# EasyEDA Pro project ProPrj_温湿度计.epro

# Schematic Schematic1
Assembly Variant: Basic; Board Name: Board1; Create Date: 2026-04-13; Page Name: P1; Project Name: 温湿度计; Schematic Name: Schematic1; Update Date: 2026-04-13; Company: 嘉立创EDA; Page Size: A4; Version: V1.0
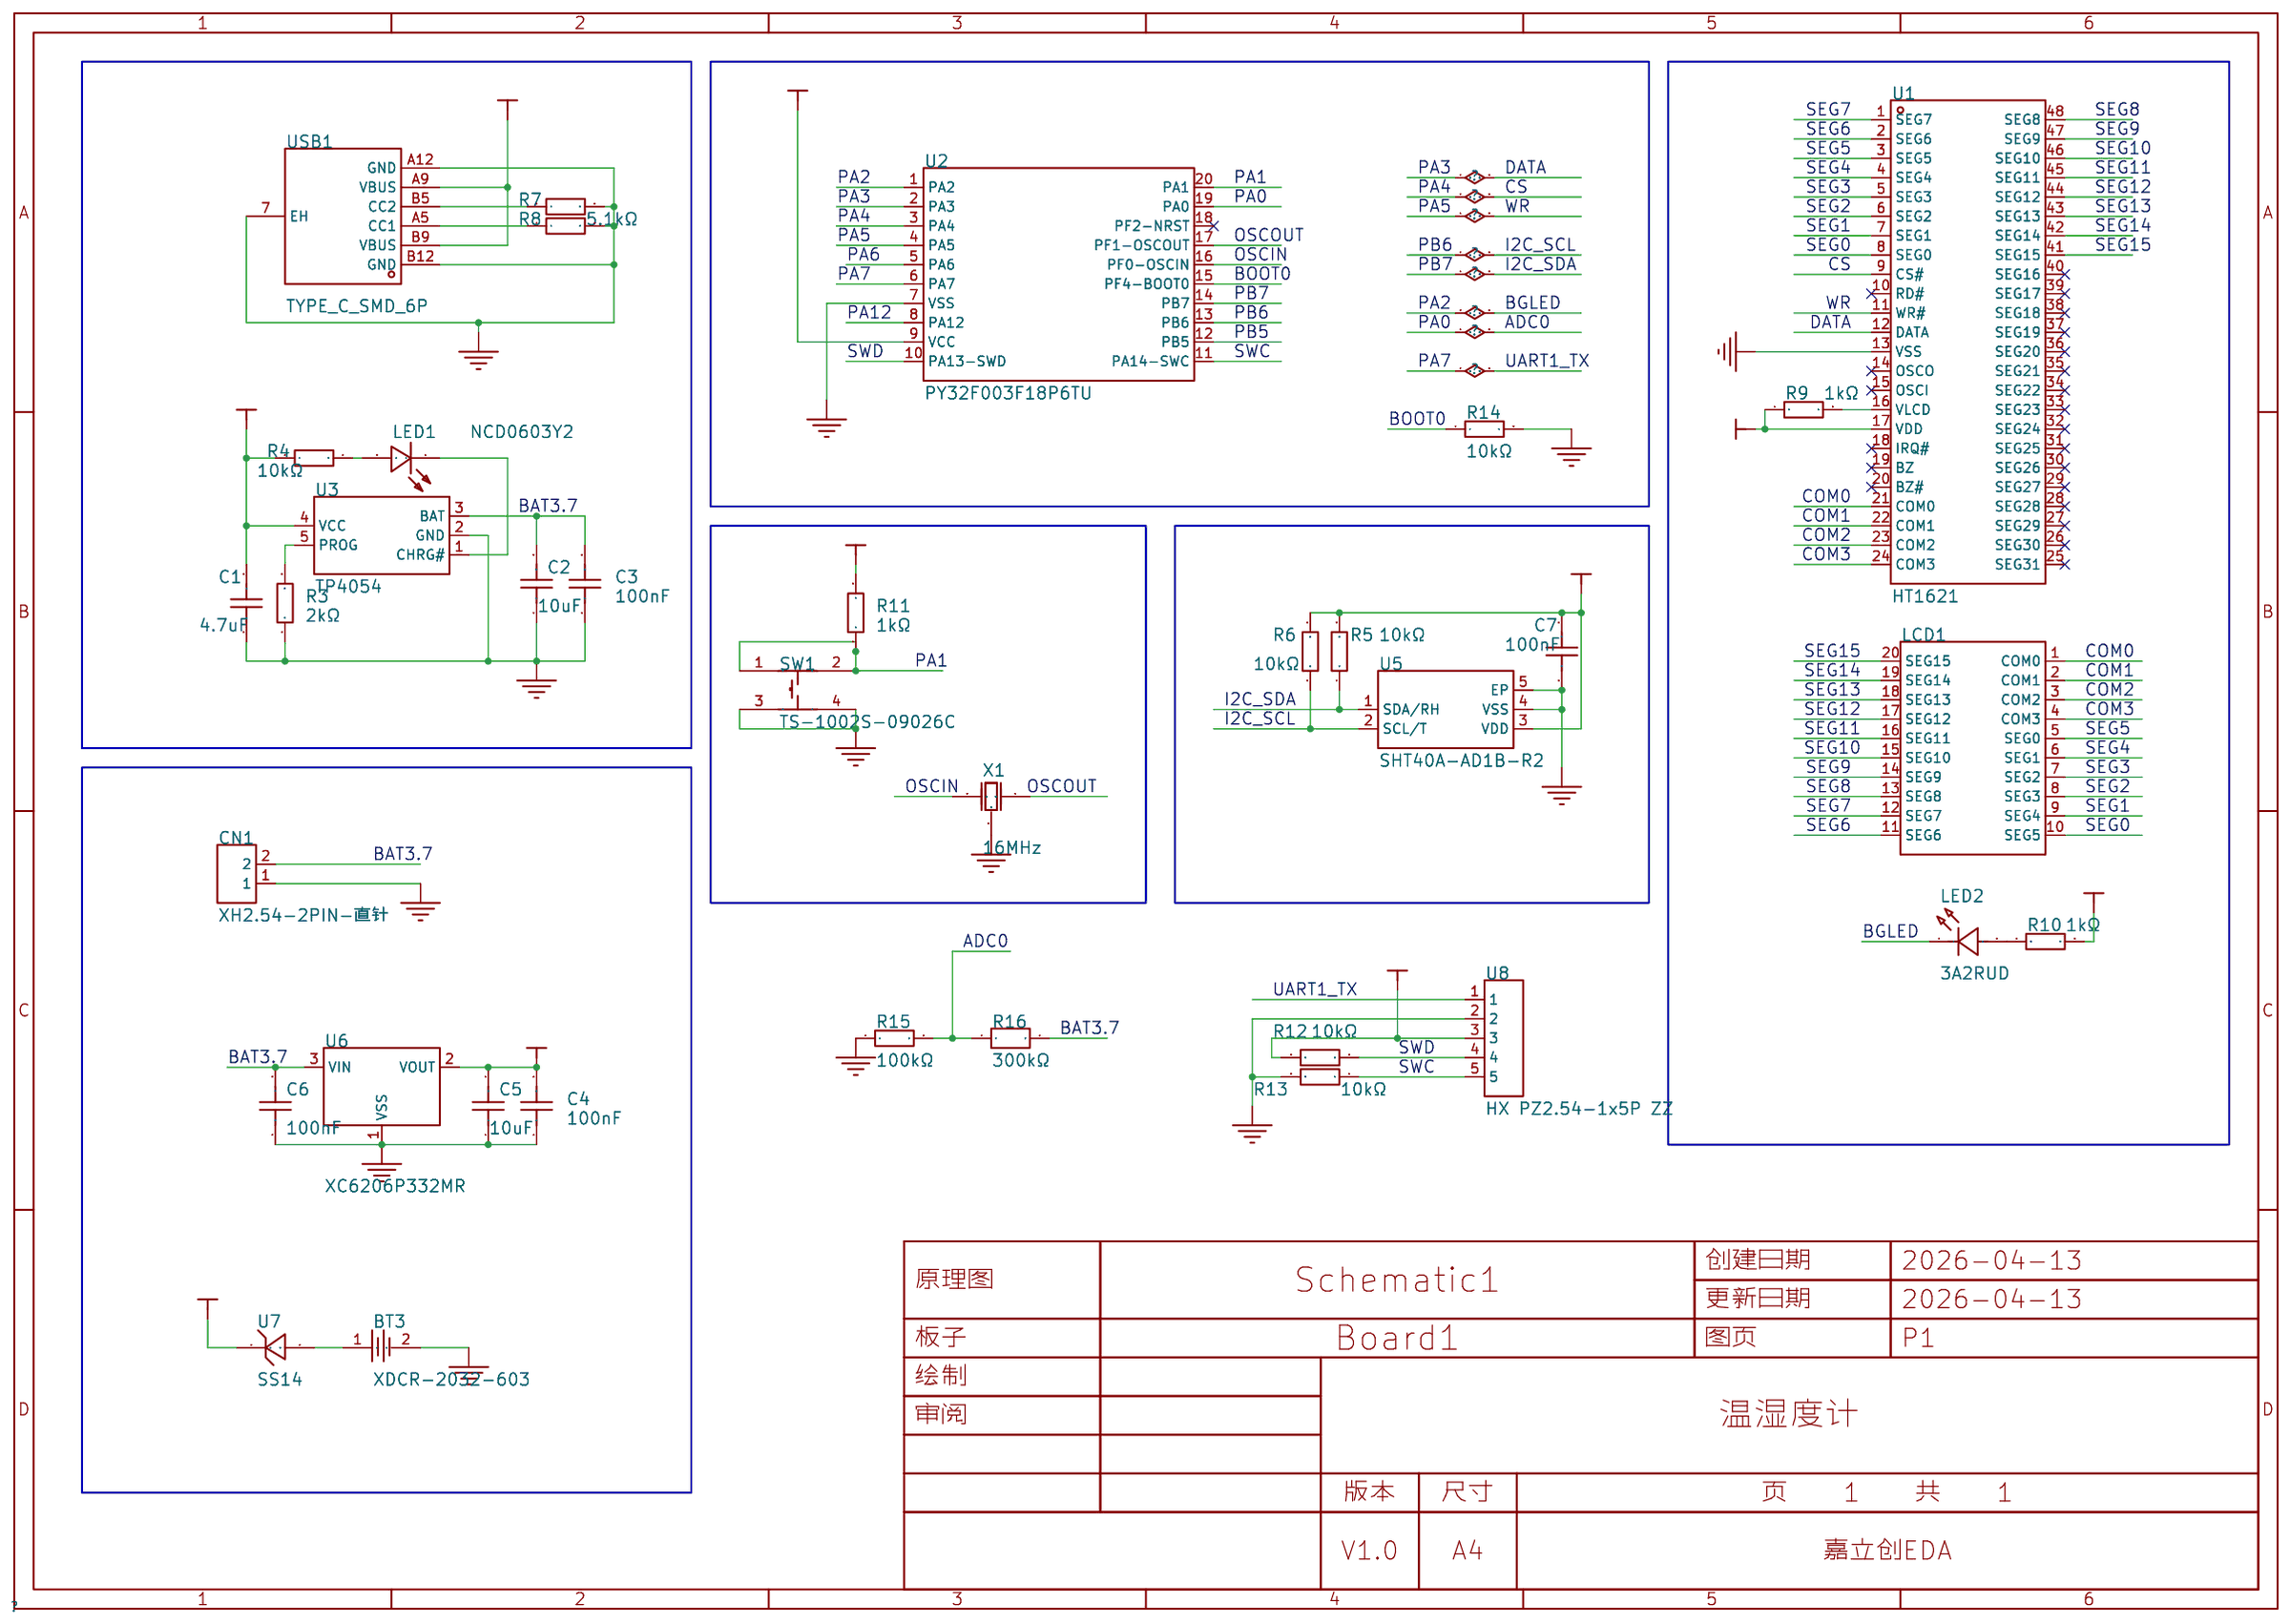
[diagram p0: schematic sheet]

## Parts
BT3  XDCR-2032-603  [BAT-SMD_XDCR-2032-603]
C1  4.7uF  [C0603]
C2  10uF  [C0603]
C3  100nF  [C0603]
C4  100nF  [C0603]
C5  10uF  [C0603]
C6  100nF  [C0603]
C7  100nF  [C0603]
CN1  XH2.54-2PIN-直针  [CONN-TH_XH2.54-2P]
LCD1  -  [段码屏]
LED1  NCD0603Y2  [LED0603-RD]
LED2  3A2RUD  [LED-TH_BD3.5-P2.28_3A2RUC]
R3  2kΩ  [R0603]
R4  10kΩ  [R0603]
R5  10kΩ  [R0603]
R6  10kΩ  [R0603]
R7  5.1kΩ  [R0603]
R8  5.1kΩ  [R0603]
R9  1kΩ  [R0603]
R10  1kΩ  [R0603]
R11  1kΩ  [R0603]
R12  10kΩ  [R0603]
R13  10kΩ  [R0603]
R14  10kΩ  [R0603]
R15  100kΩ  [R0603]
R16  300kΩ  [R0603]
SW1  TS-1002S-09026C  [KEY-SMD_4P-L6.0-W6.0-P4.50-LS9.5-BR]
U1  HT1621  [SSOP-48_L16.0-W7.6-P0.64-LS10.7-BL]
U2  PY32F003F18P6TU  [TSSOP-20_L6.5-W4.4-P0.65-LS6.4-BL]
U3  TP4054  [SOT-23-5_L2.9-W1.6-P0.95-LS2.8-BL]
U5  SHT40A-AD1B-R2  [DFN-4_L1.5-W1.5-P0.80-TL-EP]
U6  XC6206P332MR  [SOT-23-3_L2.9-W1.3-P0.95-LS2.4-BR]
U7  SS14  [SOD-323_L1.7-W1.3-LS2.6-RD-1]
U8  HX PZ2.54-1x5P ZZ  [HDR-TH_5P-P2.54-V-M]
USB1  TYPE_C_SMD_6P  [TYPE-C-SMD_TYPE-C-6P]
X1  16MHz  [OSC-SMD_3P-L3.2-W1.3-P1.20-L]

## Library data of the parts
BT3 = XDCR-2032-603: 连接器类型:电池底座;适用电池规格:CR2032;触头材质:-;触头镀层:锡;工作温度:-40℃~+85℃;; LCSC Part Name: 电池底座 适用电池:CR2032; Supplier Part: C7498148; Manufacturer: LX(连欣科技); Supplier Footprint: SMD; JLCPCB Part Class: Extended Part; Datasheet: https://item.szlcsc.com/datasheet/XDCR-2032-603/8568590.html; Supplier: LCSC; Connector Type: 电池底座; Battery Type: CR2032; Contact Plating: 锡; Operating Temperature: -40℃~+85℃
C1 = CL10A475KO8NNNC: 容值:4.7uF;精度:±10%;额定电压:16V;温度系数:X5R;; LCSC Part Name: 4.7uF ±10% 16V; Supplier Part: C19666; Manufacturer: SAMSUNG(三星); Supplier Footprint: 0603; JLCPCB Part Class: Basic Part; Datasheet: https://item.szlcsc.com/datasheet/CL10A475KO8NNNC/20375.html; Supplier: LCSC; Tolerance: ±10%; Voltage Rating: 16V; Temperature Coefficient: X5R
C2 C5 = CGA0603X5R106K100JT: 容值:10uF;精度:±10%;额定电压:10V;温度系数:X5R;; LCSC Part Name: 10uF ±10% 10V; Supplier Part: C6119842; Manufacturer: HRE(芯声); Supplier Footprint: 0603; JLCPCB Part Class: Extended Part; Datasheet: https://item.szlcsc.com/datasheet/CGA0603X5R106K100JT/7062548.html; Supplier: LCSC; Tolerance: ±10%; Voltage Rating: 10V; Temperature Coefficient: X5R
C3 C4 C6 C7 = CGA0603X7R104K500JT: 容值:100nF;精度:±10%;额定电压:50V;温度系数:X7R;; LCSC Part Name: 100nF ±10% 50V; Supplier Part: C6119867; Manufacturer: HRE(芯声); Supplier Footprint: 0603; JLCPCB Part Class: Extended Part; Datasheet: https://item.szlcsc.com/datasheet/CGA0603X7R104K500JT/7062573.html; Supplier: LCSC; Tolerance: ±10%; Voltage Rating: 50V; Temperature Coefficient: X7R
CN1 = XH2.54-2PIN-直针: Supplier Part: C9900011425; Supplier Footprint: XH2.54-2PIN; JLCPCB Part Class: Extended Part; Supplier: LCSC
LCD1 = 段码屏
LED1 = NCD0603Y2: 灯头类型:-;发光颜色:黄色;正向压降(Vf):1.6V~2.6V;功率:65mW;正向电流:25mA;波长:586nm~595nm;二极管配置:独立二极管;透镜颜色:-;色温:-;发光强度:220mcd;发光角度:130°;载带方式:-;工作温度:-30℃~+85℃;; LCSC Part Name: 片式发光二极管; Supplier Part: C89811; Manufacturer: 国星光电; Supplier Footprint: 0603; JLCPCB Part Class: Extended Part; Datasheet: https://item.szlcsc.com/datasheet/NCD0603Y2/90993.html; Supplier: LCSC; Illumination Color: 黄色; Voltage - Forward(Vf): 1.6V~2.6V; Power(Watts): 65mW; Forward Current: 25mA; Wavelength - Dominant: 586nm~595nm; Peak Wavelength: 595nm; Diode Configuration: 独立二极管; Luminous Intensity: 220mcd; Viewing Angle: 130°; Operating Temperature: -30℃~+85℃
LED2 = 3A2RUD: 灯头类型:3mm圆形灯头;发光颜色:红色;正向压降(Vf):1.8V~2.2V;正向电流:20mA;波长:620nm~625nm;透镜颜色:红色透镜;色温:-;发光强度:200mcd~400mcd;发光角度:30°;工作温度:-40℃~+85℃;; LCSC Part Name: 3mm 红发红短脚; Supplier Part: C52034637; Manufacturer: Guiguang light(桂光光电); Supplier Footprint: 插件,D=3mm; JLCPCB Part Class: Extended Part; Datasheet: https://item.szlcsc.com/datasheet/3A2RUD/54791005.html; Supplier: LCSC; Lamp Holder Type: 3mm圆形灯头; Illumination Color: 红色; Voltage - Forward(Vf): 1.8V~2.2V; Forward Current: 20mA; Wavelength - Dominant: 620nm~625nm; Peak Wavelength: 625nm; Lens Color: 红色透镜; Luminous Intensity: 200mcd~400mcd; Viewing Angle: 30°; Operating Temperature: -40℃~+85℃
R3 = 0603WAF2001T5E: 电阻类型:厚膜电阻;阻值:2kΩ;精度:±1%;功率:100mW;工作电压:75V;温度系数:±100ppm/℃;; LCSC Part Name: 2kΩ ±1% 100mW 厚膜电阻; Supplier Part: C22975; Manufacturer: UNI-ROYAL(厚声); Supplier Footprint: 0603; JLCPCB Part Class: Basic Part; Datasheet: https://item.szlcsc.com/datasheet/0603WAF2001T5E/23702.html; Supplier: LCSC; Type: 厚膜电阻; Tolerance: ±1%; Power(Watts): 100mW; Voltage-Supply(Max): 75V; Temperature Coefficient: ±100ppm/℃; Operating Temperature: -55℃~+155℃
R4-R6 R12-R14 = 0603WAF1002T5E: 电阻类型:厚膜电阻;阻值:10kΩ;精度:±1%;功率:100mW;工作电压:75V;温度系数:±100ppm/℃;; LCSC Part Name: 厚膜电阻 10kΩ ±1% 100mW; Supplier Part: C25804; Manufacturer: UNI-ROYAL(厚声); Supplier Footprint: 0603; JLCPCB Part Class: Basic Part; Datasheet: https://item.szlcsc.com/datasheet/0603WAF1002T5E/26547.html; Supplier: LCSC; Type: 厚膜电阻; Tolerance: ±1%; Power(Watts): 100mW; Voltage-Supply(Max): 75V; Temperature Coefficient: ±100ppm/℃; Operating Temperature: -55℃~+155℃
R7 R8 = 0603WAF5101T5E: 电阻类型:厚膜电阻;阻值:5.1kΩ;精度:±1%;功率:100mW;工作电压:75V;温度系数:±100ppm/℃;; LCSC Part Name: 5.1kΩ ±1% 100mW 厚膜电阻; Supplier Part: C23186; Manufacturer: UNI-ROYAL(厚声); Supplier Footprint: 0603; JLCPCB Part Class: Basic Part; Datasheet: https://item.szlcsc.com/datasheet/0603WAF5101T5E/23913.html; Supplier: LCSC; Type: 厚膜电阻; Tolerance: ±1%; Power(Watts): 100mW; Voltage-Supply(Max): 75V; Temperature Coefficient: ±100ppm/℃; Operating Temperature: -55℃~+155℃
R9-R11 = 0603WAF1001T5E: 电阻类型:厚膜电阻;阻值:1kΩ;精度:±1%;功率:100mW;工作电压:75V;温度系数:±100ppm/℃;; LCSC Part Name: 1kΩ ±1% 100mW 厚膜电阻; Supplier Part: C21190; Manufacturer: UNI-ROYAL(厚声); Supplier Footprint: 0603; JLCPCB Part Class: Basic Part; Datasheet: https://item.szlcsc.com/datasheet/0603WAF1001T5E/21904.html; Supplier: LCSC; Type: 厚膜电阻; Tolerance: ±1%; Power(Watts): 100mW; Voltage-Supply(Max): 75V; Temperature Coefficient: ±100ppm/℃; Operating Temperature: -55℃~+155℃
R15 = 0603WAF1003T5E: 电阻类型:厚膜电阻;阻值:100kΩ;精度:±1%;功率:100mW;工作电压:75V;温度系数:±100ppm/℃;; LCSC Part Name: 100kΩ ±1% 100mW 厚膜电阻; Supplier Part: C25803; Manufacturer: UNI-ROYAL(厚声); Supplier Footprint: 0603; JLCPCB Part Class: Basic Part; Datasheet: https://item.szlcsc.com/datasheet/0603WAF1003T5E/26546.html; Supplier: LCSC; Type: 厚膜电阻; Tolerance: ±1%; Power(Watts): 100mW; Voltage-Supply(Max): 75V; Temperature Coefficient: ±100ppm/℃; Operating Temperature: -55℃~+155℃
R16 = FRC0603F3003TS: 电阻类型:厚膜电阻;阻值:300kΩ;精度:±1%;功率:100mW;工作电压:75V;温度系数:±100ppm/℃;; LCSC Part Name: 300kΩ ±1% 100mW 厚膜电阻; Supplier Part: C2930091; Manufacturer: FOJAN(富捷); Supplier Footprint: 0603; JLCPCB Part Class: Extended Part; Supplier: LCSC; Type: 厚膜电阻; Tolerance: ±1%; Power(Watts): 100mW; Voltage-Supply(Max): 75V; Temperature Coefficient: ±100ppm/℃; Operating Temperature: -55℃~+155℃
SW1 = TS-1002S-09026C: 电路结构:单刀单掷;按钮形状:圆形按钮;安装方式:立贴;开关长度:6mm;开关宽度:6mm;开关高度:9mm;触点电流:50mA;额定电压:12V;带灯:-;工作寿命:-;; LCSC Part Name: 6*6*9mm 立贴 轻触开关; Supplier Part: C455118; Manufacturer: XUNPU(讯普); Supplier Footprint: SMD-4P,6x6mm; JLCPCB Part Class: Extended Part; Datasheet: https://item.szlcsc.com/datasheet/TS-1002S-09026C/457523.html; Supplier: LCSC; Circuit: 单刀单掷; Actuator Style: 圆形按钮; Mounting Type: 立贴; Length: 6mm; Width: 6mm; Switch Height: 9mm; Contact Current: 50mA; Voltage Rating: 12V
U1 = HT1621: LCSC Part Name: 被合并商品; Supplier Part: C3975090; Supplier Footprint: SSOP-48-300mil; JLCPCB Part Class: Extended Part; Supplier: LCSC
U2 = PY32F003F18P6TU: PY32F003系列微控制器采用高性能的32位ARM Cortex-M0+内核，宽电压工作范围的MCU。嵌入高达32Kbytes flash和4Kbytes SRAM存储器，最高工作频率32MHz。包含多种不同封装类型多款产品。; Supplier Part: C5379864; Manufacturer: PUYA(普冉); Supplier Footprint: TSSOP-20; JLCPCB Part Class: Extended Part; Datasheet: https://item.szlcsc.com/datasheet/PY32F003F18P6TU/6244803.html; Supplier: LCSC
U3 = TP4054: Supplier Part: C9900017699; Supplier Footprint: SOT-23-5; JLCPCB Part Class: Extended Part; Supplier: LCSC
U5 = SHT40A-AD1B-R2: 接口类型:I2C;精度:±0.3℃；±3%RH;; LCSC Part Name: 3.000.546 SHT40A-AD1B-R2; Supplier Part: C7461842; Manufacturer: Sensirion(瑞士盛思锐); JLCPCB Part Class: Extended Part; Datasheet: https://item.szlcsc.com/datasheet/SHT40A-AD1B-R2/8492034.html; Supplier: LCSC; Interface: I2C; Tolerance: ±0.3℃；±3%RH
U6 = XC6206P332MR_C6856338: Supplier Part: C6856338; Supplier Footprint: SOT23-3; JLCPCB Part Class: Extended Part; Supplier: LCSC
U7 = SS14_C9900013398: Supplier Part: C9900013398; Supplier Footprint: SS14/SOD323; JLCPCB Part Class: Extended Part; Supplier: LCSC
U8 = HX PZ2.54-1x5P ZZ: 插针结构:1x5P;间距:2.54mm;行距:-;圆针/方针:方针;安装方式:直插;排数:单排;总PIN位数:5P;额定电流:3A;额定电压:1kV;配合针长度:6mm;塑高:2.5mm;端接针长度:3mm;触头材质:黄铜;触头镀层:金;工作温度:-40℃~+105℃;颜色:黑色;; LCSC Part Name: 1x5P 间距:2.54mm 方针 直插; Supplier Part: C32713271; Manufacturer: hanxia(韩下); Supplier Footprint: 插件,P=2.54mm; JLCPCB Part Class: Extended Part; Datasheet: https://item.szlcsc.com/datasheet/HX%2520PZ2.54-1x5P%2520ZZ/34444551.html; Supplier: LCSC; Pin Structure: 1x5P; Pitch: 2.54mm; Circluar Pins/Square Pins: 方针; Mounting Type: 直插; Number of Rows: 单排; Number of Pins: 5P; Current Rating: 3A; Voltage Rating (Max): 1kV; Length of Mating Pin: 6mm; Insulation Height: 2.5mm; Length of End Connection Pin: 3mm; Contact Material: 黄铜; Contact Plating: 金; Operating Temperature: -40℃~+105℃; Color: 黑色
USB1 = TYPE_C_SMD_6P: Supplier Part: C9900003080; Supplier Footprint: TYPE_C_USB_6P; JLCPCB Part Class: Extended Part; Supplier: LCSC
X1 = CSTNE16M0V53C000R0: 频率:16MHz;内置负载电容:15pF;谐振阻抗:40Ω;; LCSC Part Name: 16MHz ±0.5% 内置负载电容:15pF; Supplier Part: C882606; Manufacturer: muRata(村田); Supplier Footprint: SMD3213-3P; JLCPCB Part Class: Extended Part; Datasheet: https://item.szlcsc.com/datasheet/CSTNE16M0V53C000R0/946713.html; Supplier: LCSC; Built - in Load Capacitance: 15pF; Resonant Impedance: 40Ω; Operating Temperature: -40℃~+125℃

## Nets
3V3: C4.2 C5.2 C7.2 R5.2 R6.2 R9.1 R10.2 R11.2 R12.1 U1.17(VDD) U2.9(VCC) U5.3(VDD) U6.2(VOUT) U7.1 U8.3
+5V: C1.2 R4.1 U3.4(VCC) USB1.A9(VBUS) USB1.B9(VBUS)
GND: BT3.2 C1.1 C2.1 C3.1 C4.1 C5.1 C6.1 C7.1 CN1.1 R3.1 R7.2 R8.2 R13.2 R14.2 R15.1 SW1.3 SW1.4 U1.13(VSS) U2.7(VSS) U3.2(GND) U5.4(VSS) U5.5(EP) U6.1(VSS) U8.2 USB1.7(EH) USB1.A12(GND) USB1.B12(GND) X1.2(GND)
ADC0: R15.2 R16.1 U2.19(PA0)
BAT3.7: C2.2 C3.2 C6.2 CN1.2 R16.2 U3.3(BAT) U6.3(VIN)
BGLED: LED2.1(K) U2.1(PA2)
BOOT0: R14.1 U2.15(PF4-BOOT0)
COM0: LCD1.1(COM0) U1.21(COM0)
COM1: LCD1.2(COM1) U1.22(COM1)
COM2: LCD1.3(COM2) U1.23(COM2)
COM3: LCD1.4(COM3) U1.24(COM3)
CS: U1.9(CS#) U2.3(PA4)
DATA: U1.12(DATA) U2.2(PA3)
I2C_SCL: R6.1 U2.13(PB6) U5.2(SCL/T)
I2C_SDA: R5.1 U2.14(PB7) U5.1(SDA/RH)
OSCIN: U2.16(PF0-OSCIN) X1.3(OSC2)
OSCOUT: U2.17(PF1-OSCOUT) X1.1(OSC1)
PA1: R11.1 SW1.1 SW1.2 U2.20(PA1)
PA5: U1.11(WR#) U2.4(PA5)
PA6: U2.5(PA6)
PA7: U2.6(PA7) U8.1
PA12: U2.8(PA12)
PB5: U2.12(PB5)
SEG0: LCD1.10(SEG5) U1.8(SEG0)
SEG1: LCD1.9(SEG4) U1.7(SEG1)
SEG2: LCD1.8(SEG3) U1.6(SEG2)
SEG3: LCD1.7(SEG2) U1.5(SEG3)
SEG4: LCD1.6(SEG1) U1.4(SEG4)
SEG5: LCD1.5(SEG0) U1.3(SEG5)
SEG6: LCD1.11(SEG6) U1.2(SEG6)
SEG7: LCD1.12(SEG7) U1.1(SEG7)
SEG8: LCD1.13(SEG8) U1.48(SEG8)
SEG9: LCD1.14(SEG9) U1.47(SEG9)
SEG10: LCD1.15(SEG10) U1.46(SEG10)
SEG11: LCD1.16(SEG11) U1.45(SEG11)
SEG12: LCD1.17(SEG12) U1.44(SEG12)
SEG13: LCD1.18(SEG13) U1.43(SEG13)
SEG14: LCD1.19(SEG14) U1.42(SEG14)
SEG15: LCD1.20(SEG15) U1.41(SEG15)
SWC: R13.1 U2.11(PA14-SWC) U8.5
SWD: R12.2 U2.10(PA13-SWD) U8.4
$1N3: R8.1 USB1.A5(CC1)
$1N4: R7.1 USB1.B5(CC2)
$1N8: LED1.1(K) U3.1(CHRG#)
$1N9: R3.2 U3.5(PROG)
$1N12: LED1.2(A) R4.2
$1N169: R9.2 U1.16(VLCD)
$1N233: LED2.2(A) R10.1
$1N250: BT3.1 U7.2

Not connected (* = marked no-connect by the designer): U1 10(RD#)* 14(OSCO)* 15(OSCI)* 18(IRQ#)* 19(BZ)* 20(BZ#)* 25(SEG31)* 26(SEG30)* 27(SEG29)* 28(SEG28)* 29(SEG27)* 30(SEG26)* 31(SEG25)* 32(SEG24)* 33(SEG23)* 34(SEG22)* 35(SEG21)* 36(SEG20)* 37(SEG19)* 38(SEG18)* 39(SEG17)* 40(SEG16)*; U2 18(PF2-NRST)*

# Board PCB1
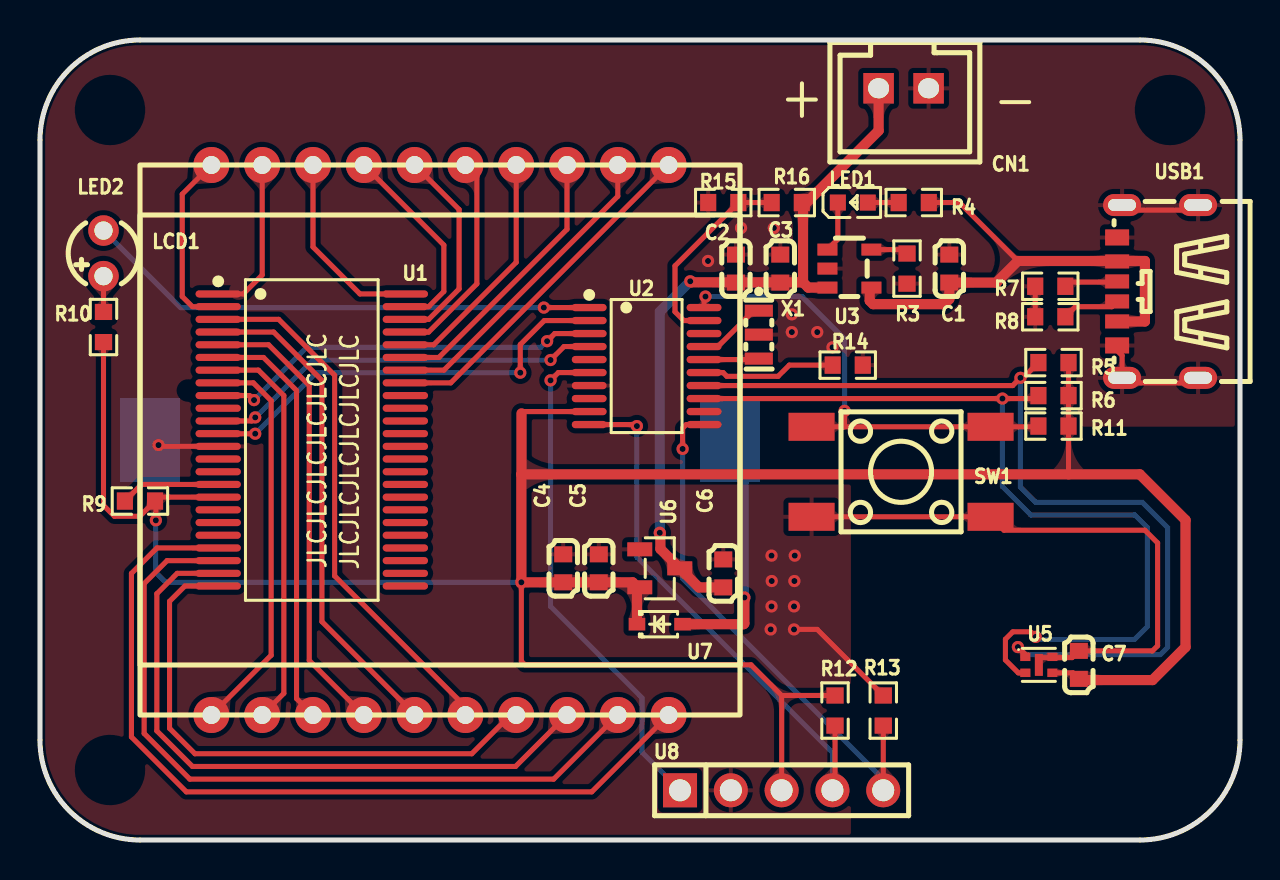
[diagram p1: board, top side]
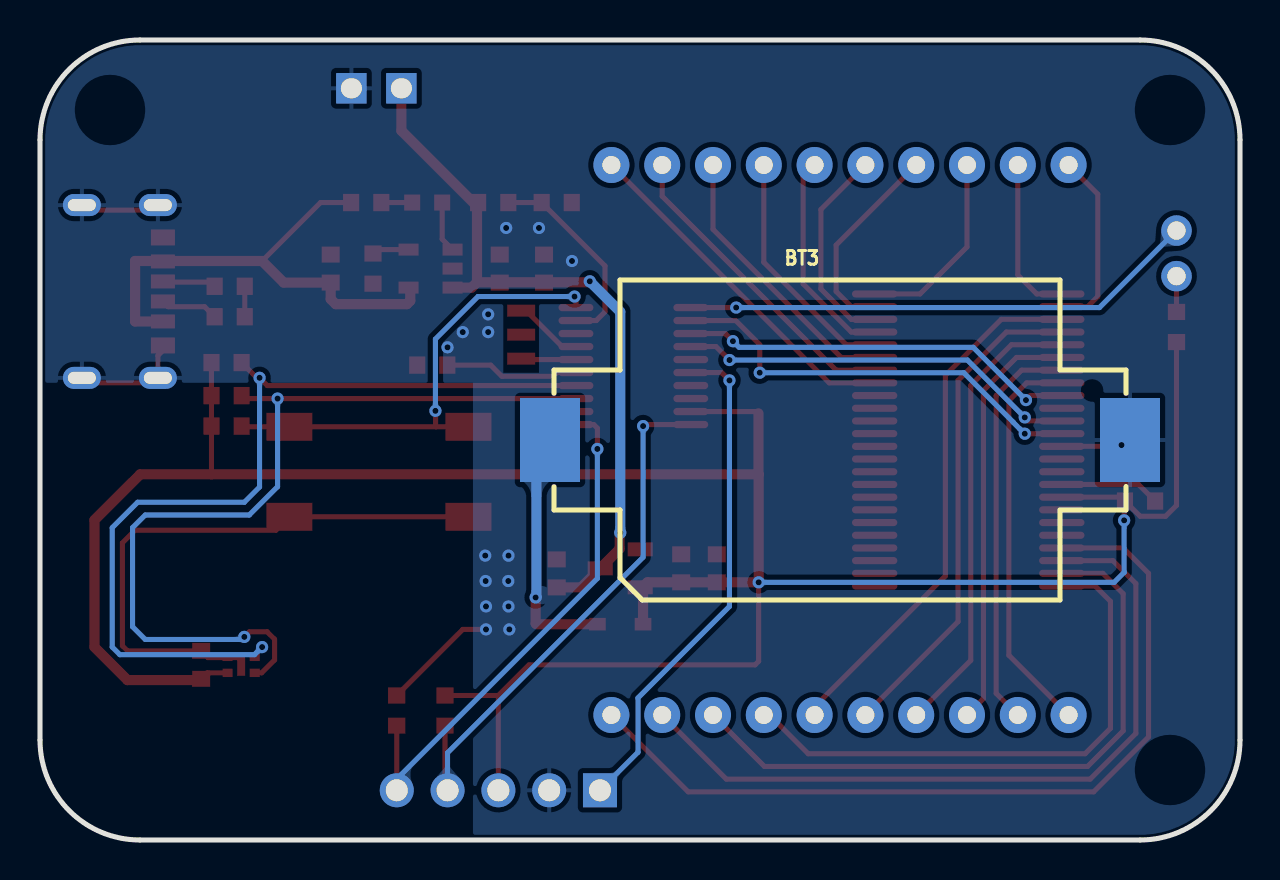
[diagram p2: board, bottom side, seen from below]

Outline 60 x 40 mm; copper layers: Top Layer, Bottom Layer. Coordinates in mm from the lower left corner of the outline.
Outline path: 0,35 0,5 arc(1.46,1.46) 5,0 55,0 arc(58.54,1.46) 60,5 60,35 arc(58.54,38.54) 55,40 5,40 arc(1.46,38.54) 0,35
Stack: Top Layer 0.035mm / Dielectric1 1.51mm FR4 er 4.5 / Bottom Layer 0.035mm

## Design rules (mm)
spacing copperThickness1oz (default): track to track 0.102, other pairs 0.152 to 0.3
spacing copperThickness2oz: track to track 0.203, other pairs 0.152 to 0.3
track width copperThickness1oz (default): min 0.127, default 0.254, max 2.54
track width copperThickness2oz: min 0.203, default 0.254, max 2.54
differential pair differentialPair (default): width min 0.127, default 0.254, max 2.54; gap min 0.152, default 0.152
net GND uses copperRegion

## Placement (name value [footprint] x y rotation side)
BT3  XDCR-2032-603  [BAT-SMD_XDCR-2032-603]  20 20 180 bottom
C1  4.7uF  [C0603]  45.47 28.57 270 top
C2  10uF  [C0603]  34.8 28.57 270 top
C3  100nF  [C0603]  37.01 28.57 270 top
C4  100nF  [C0603]  26.16 13.58 270 top
C5  10uF  [C0603]  27.94 13.58 270 top
C6  100nF  [C0603]  34.16 13.33 270 top
C7  100nF  [C0603]  51.94 8.76 270 top
CN1  XH2.54-2PIN-直针  [CONN-TH_XH2.54-2P]  43.18 37.59 180 top
LCD1  -  [段码屏]  20 20 0 top
LED1  NCD0603Y2  [LED0603-RD]  40.64 31.87 0 top
LED2  3A2RUD  [LED-TH_BD3.5-P2.28_3A2RUC]  3.17 29.33 90 top
R3  2kΩ  [R0603]  43.35 28.57 90 top
R4  10kΩ  [R0603]  43.69 31.87 180 top
R5  10kΩ  [R0603]  50.67 23.87 0 top
R6  10kΩ  [R0603]  50.67 22.22 0 top
R7  5.1kΩ  [R0603]  50.51 27.69 180 top
R8  5.1kΩ  [R0603]  50.51 26.16 180 top
R9  1kΩ  [R0603]  5 16.95 180 top
R10  1kΩ  [R0603]  3.17 25.65 270 top
R11  1kΩ  [R0603]  50.67 20.7 0 top
R12  10kΩ  [R0603]  39.75 6.47 270 top
R13  10kΩ  [R0603]  42.16 6.47 90 top
R14  10kΩ  [R0603]  40.39 23.74 0 top
R15  100kΩ  [R0603]  34.16 31.87 0 top
R16  300kΩ  [R0603]  37.34 31.87 0 top
SW1  TS-1002S-09026C  [KEY-SMD_4P-L6.0-W6.0-P4.50-LS9.5-BR]  43.05 18.41 180 top
U1  HT1621  [SSOP-48_L16.0-W7.6-P0.64-LS10.7-BL]  13.59 20 270 top
U2  PY32F003F18P6TU  [TSSOP-20_L6.5-W4.4-P0.65-LS6.4-BL]  30.33 23.7 270 top
U3  TP4054  [SOT-23-5_L2.9-W1.6-P0.95-LS2.8-BL]  40.47 28.57 270 top
U5  SHT40A-AD1B-R2  [DFN-4_L1.5-W1.5-P0.80-TL-EP]  49.94 8.76 0 top
U6  XC6206P332MR  [SOT-23-3_L2.9-W1.3-P0.95-LS2.4-BR]  30.99 13.58 180 top
U7  SS14  [SOD-323_L1.7-W1.3-LS2.6-RD-1]  30.99 10.79 0 top
U8  HX PZ2.54-1x5P ZZ  [HDR-TH_5P-P2.54-V-M]  37.08 2.49 0 top
USB1  TYPE_C_SMD_6P  [TYPE-C-SMD_TYPE-C-6P]  55.88 27.43 90 top
X1  16MHz  [OSC-SMD_3P-L3.2-W1.3-P1.20-L]  35.94 25.27 270 top

## Footprints (pads in the part's own frame, mm; a bottom-side part is the same pattern mirrored in y, then rotated)
BAT-SMD_XDCR-2032-603
  rect 3x4.2 smd: 1(-14.5,0) 2(14.5,0)
C0603
  rect 0.8x0.9 smd: 1(-0.7,0) 2(0.7,0)
CONN-TH_XH2.54-2P
  rect 1.524x1.524 hole 1.05x1: 1(-1.25,0) 2(1.25,0)
DFN-4_L1.5-W1.5-P0.80-TL-EP
  rect 0.505x0.42 smd: 1(-0.677,0.4) 2(-0.677,-0.4) 3(0.677,-0.4) 4(0.677,0.4)
  rect 0.4x1.1 smd: 5(0,0)
HDR-TH_5P-P2.54-V-M
  rect 1.7x1.7 hole 1.1: 1(-5.08,0)
  round 1.7 hole 1.1: 2(-2.54,0) 3(0,0) 4(2.54,0) 5(5.08,0)
KEY-SMD_4P-L6.0-W6.0-P4.50-LS9.5-BR
  rect 2.3x1.4 smd: 1(4.475,-2.25) 2(-4.475,-2.25) 3(4.475,2.25) 4(-4.475,2.25)
LED0603-RD
  rect 0.8x0.8 smd: 1(-0.749,0) 2(0.749,0)
LED-TH_BD3.5-P2.28_3A2RUC
  round 1.524 hole 0.914: 1(1.14,0) 2(-1.14,0)
OSC-SMD_3P-L3.2-W1.3-P1.20-L
  rect 0.6x1.4 smd: 1(-1.199,0) 2(0,0) 3(1.199,0)
R0603
  rect 0.806x0.864 smd: 1(-0.753,0) 2(0.753,0)
SOD-323_L1.7-W1.3-LS2.6-RD-1
  rect 0.83x0.63 smd: 1(-1.14,0) 2(1.14,0)
SOT-23-3_L2.9-W1.3-P0.95-LS2.4-BR
  rect 1.25x0.7 smd: 1(1,-0.95) 2(1,0.95) 3(-1,0)
SOT-23-5_L2.9-W1.6-P0.95-LS2.8-BL
  rect 0.6x1 smd: 1(-0.95,-1.1) 2(0,-1.1) 3(0.95,-1.1) 4(0.95,1.1) 5(-0.95,1.1)
SSOP-48_L16.0-W7.6-P0.64-LS10.7-BL
  oval 0.355x2.267 smd: 1(-7.303,-4.678) 2(-6.668,-4.678) 3(-6.032,-4.678) 4(-5.397,-4.678) 5(-4.763,-4.678) 6(-4.128,-4.678) 7(-3.493,-4.678) 8(-2.857,-4.678) 9(-2.223,-4.678) 10(-1.587,-4.678) 11(-0.953,-4.678) 12(-0.318,-4.678) 13(0.318,-4.678) 14(0.953,-4.678) 15(1.587,-4.678) 16(2.223,-4.678) 17(2.857,-4.678) 18(3.493,-4.678) 19(4.128,-4.678) 20(4.763,-4.678) 21(5.397,-4.678) 22(6.032,-4.678) 23(6.668,-4.678) 24(7.303,-4.678) 25(7.303,4.678) 26(6.668,4.678) 27(6.032,4.678) 28(5.397,4.678) 29(4.763,4.678) 30(4.128,4.678) 31(3.493,4.678) 32(2.857,4.678) 33(2.223,4.678) 34(1.587,4.678) 35(0.953,4.678) 36(0.318,4.678) 37(-0.318,4.678) 38(-0.953,4.678) 39(-1.587,4.678) 40(-2.223,4.678) 41(-2.857,4.678) 42(-3.493,4.678) 43(-4.128,4.678) 44(-4.763,4.678) 45(-5.397,4.678) 46(-6.032,4.678) 47(-6.668,4.678) 48(-7.303,4.678)
TSSOP-20_L6.5-W4.4-P0.65-LS6.4-BL
  oval 0.364x1.742 smd: 1(-2.925,-2.871) 2(-2.275,-2.871) 3(-1.625,-2.871) 4(-0.975,-2.871) 5(-0.325,-2.871) 6(0.325,-2.871) 7(0.975,-2.871) 8(1.625,-2.871) 9(2.275,-2.871) 10(2.925,-2.871) 11(2.925,2.871) 12(2.275,2.871) 13(1.625,2.871) 14(0.975,2.871) 15(0.325,2.871) 16(-0.325,2.871) 17(-0.975,2.871) 18(-1.625,2.871) 19(-2.275,2.871) 20(-2.925,2.871)
TYPE-C-SMD_TYPE-C-6P
  oval 1.1x1.9 hole 0.6x1.4: 7(-4.32,1.775) 7(-4.32,-2.025) 7(4.32,1.775) 7(4.32,-2.025)
  rect 0.7x1.2 smd: A5(-0.5,2.025) A9(1.5,2.025) B5(0.5,2.025) B9(-1.5,2.025)
  rect 0.8x1.2 smd: A12(2.7,2.025) B12(-2.7,2.025)
段码屏
  round 1.8 hole 0.9: 1(11.43,-13.75) 2(8.89,-13.75) 3(6.35,-13.75) 4(3.81,-13.75) 5(1.27,-13.75) 6(-1.27,-13.75) 7(-3.81,-13.75) 8(-6.35,-13.75) 9(-8.89,-13.75) 10(-11.43,-13.75) 11(-11.43,13.75) 12(-8.89,13.75) 13(-6.35,13.75) 14(-3.81,13.75) 15(-1.27,13.75) 16(1.27,13.75) 17(3.81,13.75) 18(6.35,13.75) 19(8.89,13.75) 20(11.43,13.75)

## Nets
As in the schematic.

Pads without a net: U1 10 14 15 18 19 20 25 26 27 28 29 30 31 32 33 34 35 36 37 38 39 40; U2 18

## Via types
v1: diameter 0.61, hole 0.305, Top Layer to Bottom Layer, 37 vias

## Routing (per net, layer and track width the routed paths; a pad name or vN(x,y) marks a point on that pad's centre or on a via; arc(x,y) is an arc through that point)
3V3: length 134.7
  Top Layer w0.254: 24.08,21.33 24.17,21.42 U2.9 ; 37.08,7.23 35.55,8.76 24.25,8.76 24.07,8.94 v1(24.07,12.88) ; 37.08,7.23 R12.1 ; 37.08,7.23 37.08,2.53 ; C7.2 51.64,8.36 U5.3 ; R5.2 R6.2 R11.2 51.43,18.28 ; v1(5.79,15.98) 5.79,16.91 R9.1 ; R9.1 4.99,16.19 3.72,16.19 3.17,16.73 R10.2 ; R9.1 5.95,17.14 U1.17
  Top Layer w0.508: 29.88,12.63 29.85,12.6 29.85,11.04 ; 29.88,12.63 U6.2 ; 29.88,12.63 29.63,12.88 C5.2 C4.2 v1(24.07,12.88) 24.07,18.28 ; 24.08,21.33 24.08,18.29 24.07,18.28 ; 24.07,18.28 54.99,18.28 57.28,16 57.28,9.65 55.63,8 52,8 C7.2
  Bottom Layer w0.254: v1(5.79,15.98) 5.79,13.38 6.29,12.88 v1(24.07,12.88)
+5V: length 26
  Top Layer w0.254: 48.9,28.95 45.97,31.87 R4.1 ; U3.4 41.49,27.62
  Top Layer w0.508: 41.49,27.62 41.49,26.96 41.66,26.79 45.21,26.79 45.47,27.05 C1.2 47.81,27.87 48.9,28.95 55.25,28.95 55.25,25.93 USB1.B9
GND: length 48.9
  Top Layer w0.254: 49.9,9.09 49.93,9.12 51.6,9.12 C7.1 55.63,9.46 55.88,9.71 55.88,14.85 55.25,15.49 48.2,15.49 SW1.4 SW1.3 ; v1(5.92,19.75) 5.99,19.68 U1.13 ; R7.2 R8.2 ; 54.1,31.49 57.91,31.49 ; 57.91,22.85 54.1,22.85 54.1,24.22 53.85,24.47 ; v1(37.7,10.53) 38.86,10.53 R13.2
  vias: v1(33.4,28.95) v1(35.05,30.6) v1(36.53,10.53) v1(36.58,14.22) v1(36.59,12.95) v1(36.58,11.68) v1(36.69,30.6) v1(37.59,26.28) v1(37.59,25.39) v1(37.74,14.22) v1(37.72,12.95) v1(37.7,11.68) v1(38.86,25.39) v1(39.62,24.63)
ADC0: length 10.1
  Top Layer w0.254: R16.1 R15.2 31.75,28.71 31.75,26.41 32.19,25.97 U2.19
BAT3.7: length 36.1
  Top Layer w0.508: 39.29,27.62 38.41,27.62 38.15,27.88 ; v1(32.51,27.94) 32.56,27.88 38.15,27.88 ; 38.15,27.88 38.15,31.69 41.93,35.47 CN1.2 ; C6.2 32.94,12.63 U6.3 31.02,14.55 31.02,15.33 v1(30.99,15.36)
  Bottom Layer w0.508: v1(32.51,27.94) 30.99,26.41 v1(30.99,15.36)
BGLED: length 25.9
  Top Layer w0.254: U2.1 v1(25.19,26.62)
  Bottom Layer w0.254: v1(25.19,26.62) 7.03,26.62 LED2.1
BOOT0: length 6.7
  Top Layer w0.254: U2.15 34.15,23.37 34.34,23.18 36.9,23.18 37.47,23.74 R14.1
COM0: length 42.6
  Top Layer w0.254: LCD1.1 27.59,2.41 7.32,2.41 4.57,5.15 4.57,13.33 5.84,14.6 U1.21
COM1: length 37.6
  Top Layer w0.254: U1.22 6.35,13.97 5.21,12.82 5.21,5.33 7.49,3.04 25.68,3.04 LCD1.2
COM2: length 32.7
  Top Layer w0.254: U1.23 6.86,13.33 5.84,12.31 5.84,5.46 7.62,3.68 23.78,3.68 LCD1.3
COM3: length 27.8
  Top Layer w0.254: U1.24 7.24,12.7 6.48,11.93 6.48,5.58 7.75,4.31 21.59,4.31 23.53,6.25 LCD1.4
CS: length 20
  Top Layer w0.254: v1(25.35,24.94) 25.74,25.32 U2.3 ; v1(10.7,22) 10.47,22.22 U1.9
  Bottom Layer w0.254: v1(10.7,22) 13.34,24.63 25.05,24.63 v1(25.35,24.94)
DATA: length 21.7
  Top Layer w0.254: 8.91,20.31 U1.12 8.91,20.31 ; 8.91,20.31 v1(10.76,20.31) ; U2.2 25.21,25.97 24.01,24.77 v1(24.01,23.37)
  Bottom Layer w0.254: v1(24.01,23.37) 24.01,23.36 13.81,23.36 11.34,20.9 11.34,20.89 11,20.55 10.99,20.55 v1(10.76,20.31)
I2C_SCL: length 44.2
  Top Layer w0.254: U5.2 48.91,8.36 48.27,9 48.27,10.04 48.64,10.41 49.53,10.41 v1(49.78,10.16) ; U2.13 v1(48.12,22.07) 49.77,22.07 R6.1
  Bottom Layer w0.254: v1(48.12,22.07) 48.12,17.66 49.53,16.25 54.74,16.25 55.37,15.62 55.37,10.66 54.74,10.03 49.91,10.03 v1(49.78,10.16)
I2C_SDA: length 45.3
  Top Layer w0.254: U2.14 48.63,22.72 v1(49.02,23.11) 49.16,23.11 R5.1 ; U5.1 49.27,9.28 v1(48.9,9.65)
  Bottom Layer w0.254: v1(48.9,9.65) 49.28,9.27 56.01,9.27 56.39,9.65 56.39,15.62 55.12,16.89 49.78,16.89 49.02,17.65 v1(49.02,23.11)
OSCIN: length 2.8
  Top Layer w0.254: X1.3 35.89,24.02 U2.16
OSCOUT: length 3.5
  Top Layer w0.254: U2.17 33.89,24.67 35.69,26.47 X1.1
PA1: length 24.2
  Top Layer w0.254: v1(40.23,21.46) 40.22,21.45 40.22,20.66 ; R11.1 49.88,20.66 SW1.2 40.22,20.66 ; 40.22,20.66 SW1.1 ; U2.20 33.2,27.1 v1(33.27,27.17)
  Bottom Layer w0.254: v1(33.27,27.17) 38.1,27.17 40.23,25.04 v1(40.23,21.46)
PA5: length 20.1
  Top Layer w0.254: U2.4 26.2,24.67 v1(25.53,24) ; v1(10.76,21.13) 10.58,20.95 U1.11
  Bottom Layer w0.254: v1(25.53,24) 13.63,24 v1(10.76,21.13)
PA7: length 25.3
  Top Layer w0.254: v1(25.53,22.98) 25.92,23.37 U2.6
  Bottom Layer w0.254: U8.1 30.1,4.39 30.1,7.11 25.53,11.68 v1(25.53,22.98)
SEG0: length 20
  Top Layer w0.254: U1.8 10.67,22.86 11.56,21.97 11.56,9.24 LCD1.10
SEG1: length 20.2
  Top Layer w0.254: LCD1.9 12.19,7.33 12.19,22.22 10.92,23.49 U1.7
SEG2: length 21.2
  Top Layer w0.254: U1.6 11.17,24.13 12.83,22.47 12.83,7.07 LCD1.8
SEG3: length 23
  Top Layer w0.254: LCD1.7 13.46,8.98 13.46,22.73 11.43,24.76 U1.5
SEG4: length 24.8
  Top Layer w0.254: LCD1.6 18.73,6.28 14.1,10.92 14.1,22.98 11.68,25.4 U1.4
SEG5: length 26.7
  Top Layer w0.254: U1.3 11.94,26.03 14.73,23.24 14.73,13.2 21.27,6.67 LCD1.5
SEG6: length 9.2
  Top Layer w0.254: U1.2 7.62,26.67 7.11,27.17 7.11,32.29 LCD1.11
SEG7: length 8.1
  Top Layer w0.254: U1.1 10.16,27.3 11.11,28.25 LCD1.12
SEG8: length 9.7
  Top Layer w0.254: LCD1.13 13.65,29.65 16,27.3 U1.48
SEG9: length 10.2
  Top Layer w0.254: U1.47 19.43,26.67 20.19,27.43 20.19,29.75 LCD1.14
SEG10: length 10.4
  Top Layer w0.254: U1.46 19.43,26.03 20.96,27.55 20.96,31.53 LCD1.15
SEG11: length 10.8
  Top Layer w0.254: LCD1.16 21.84,33.18 21.84,27.81 19.43,25.4 U1.45
SEG12: length 12.1
  Top Layer w0.254: LCD1.17 23.81,28.89 19.69,24.76 U1.44
SEG13: length 14
  Top Layer w0.254: U1.43 19.94,24.13 26.35,30.54 LCD1.18
SEG14: length 15.8
  Top Layer w0.254: LCD1.19 28.89,32.19 20.2,23.49 U1.42
SEG15: length 17.7
  Top Layer w0.254: U1.41 20.54,22.86 LCD1.20
SWC: length 26.5
  Top Layer w0.254: U2.11 32.31,20.77 32.13,20.59 v1(32.13,19.55) ; 42.16,2.53 R13.1
  Bottom Layer w0.254: v1(32.13,19.55) 32.13,13.08 42.16,3.04 42.16,2.53
SWD: length 27.9
  Top Layer w0.254: R12.2 39.75,2.66 39.62,2.53 ; v1(29.84,20.7) 29.77,20.77 U2.10
  Bottom Layer w0.254: 39.62,2.53 39.62,4.36 29.84,14.14 v1(29.84,20.7)
$1N3: length 2.9
  Top Layer w0.254: R8.1 51.77,26.67 53.59,26.67 USB1.A5
$1N4: length 2.7
  Top Layer w0.254: USB1.B5 53.82,27.89 51.48,27.89 R7.1
$1N8: length 2.6
  Top Layer w0.254: LED1.1 39.89,30.04 U3.1
$1N9: length 1.9
  Top Layer w0.254: U3.5 43.15,29.52 R3.2
$1N12: length 1.5
  Top Layer w0.254: LED1.2 R4.2
$1N169: length 5
  Top Layer w0.254: U1.16 5.07,17.78 R9.2
$1N233: length 1.8
  Top Layer w0.254: LED2.2 R10.1
$1N250: length 12.6
  Top Layer w0.508: v1(35.22,12.13) 35.22,10.83 35.18,10.79 U7.2
  Bottom Layer w0.508: BT3.1 35.18,19.32 35.18,12.17 v1(35.22,12.13)

## Copper pours and planes (outline as drawn; the poured copper is in the pictures)
GND on Top Layer: -3.17,42.79 61.98,42.79 61.98,-4.32 -3.17,-4.32
GND on Bottom Layer: -3.56,43.81 64.77,43.81 64.77,-5.34 -3.56,-5.34

Small or netless copper shapes (teardrops, artwork), in the pictures only: 181 on Top Layer, 26 on Bottom Layer

## Text on the board
Top Silkscreen Layer: JLCJLCJLCJLCJLCJLC | + | -
